# Altium schematic sheet WIFIBT_AP6212.SchDoc
size A4
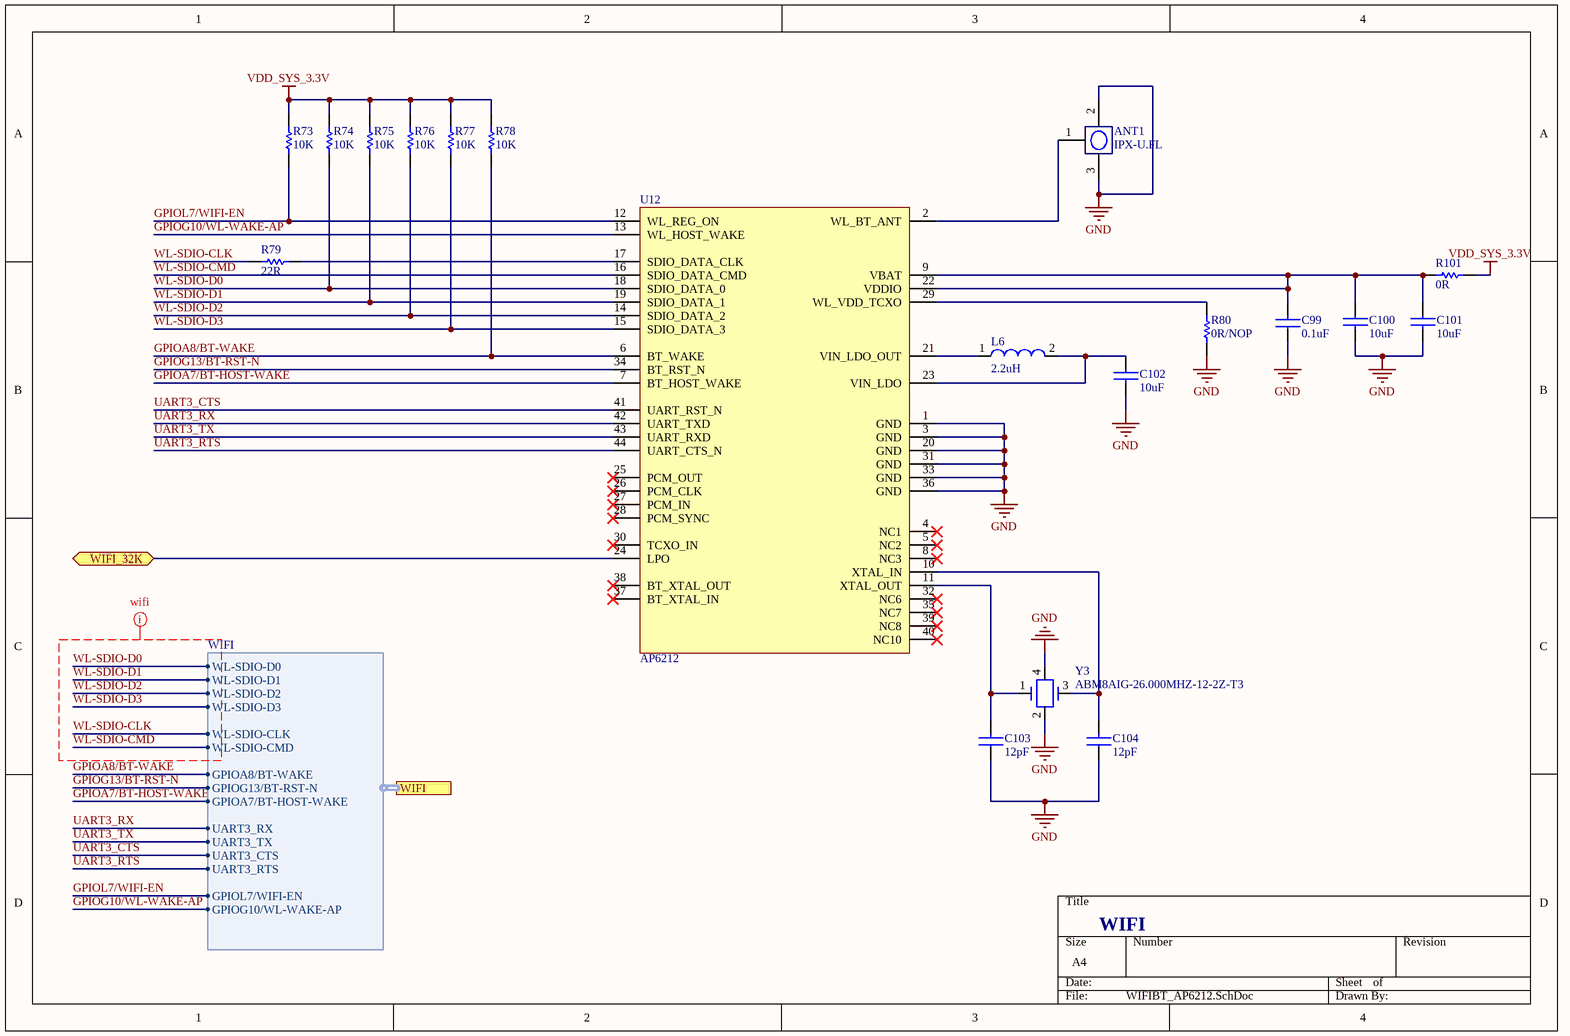
[diagram p0: WIFIBT_AP6212.SchDoc]

## Parts
ANT1  IPX-U.FL  [UFL]
C99  0.1uF  [C0402]
C100  10uF  [C0603]
C101  10uF  [C0603]
C102  10uF  [C0603]
C103  12pF  [C0402]
C104  12pF  [C0402]
L6  2.2uH  [L1008]
R73  value 10K  [R0402]  (hidden comment: 10K,1%)
R74  value 10K  [R0402]  (hidden comment: 10K,1%)
R75  value 10K  [R0402]  (hidden comment: 10K,1%)
R76  value 10K  [R0402]  (hidden comment: 10K,1%)
R77  value 10K  [R0402]  (hidden comment: 10K,1%)
R78  value 10K  [R0402]  (hidden comment: 10K,1%)
R79  22R  [R0402]
R80  0R/NOP  [R0402]
R101  0R  [R0402]
U12  AP6212  [AP6212_44_12X12]
Y3  ABM8AIG-26.000MHZ-12-2Z-T3  [XTL_4_3225]

## Ports
WIFI (harness WIFI), WIFI_32K (bidir)

## Harnesses
WIFI: WL-SDIO-D0, WL-SDIO-D1, WL-SDIO-D2, WL-SDIO-D3, WL-SDIO-CLK, WL-SDIO-CMD, GPIOA8/BT-WAKE, GPIOG13/BT-RST-N, GPIOA7/BT-HOST-WAKE, UART3_RX, UART3_TX, UART3_CTS, UART3_RTS, GPIOL7/WIFI-EN, GPIOG10/WL-WAKE-AP

## Nets
GND: ANT1.2 ANT1.3 C99.1 C100.2 C101.2 C102.2 C103.1 C104.1 R80.1 U12.1(GND) U12.3(GND) U12.20(GND) U12.31(GND) U12.33(GND) U12.36(GND) Y3.2 Y3.4
VDD_SYS_3.3V: R73.2 R74.2 R75.2 R76.2 R77.2 R78.2 R101.1
GPIOA7/BT-HOST-WAKE: U12.7(BT_HOST_WAKE) ; port WIFI.GPIOA7/BT-HOST-WAKE
GPIOA8/BT-WAKE: R78.1 U12.6(BT_WAKE) ; port WIFI.GPIOA8/BT-WAKE
GPIOG10/WL-WAKE-AP: U12.13(WL_HOST_WAKE) ; port WIFI.GPIOG10/WL-WAKE-AP
GPIOG13/BT-RST-N: U12.34(BT_RST_N) ; port WIFI.GPIOG13/BT-RST-N
GPIOL7/WIFI-EN: R73.1 U12.12(WL_REG_ON) ; port WIFI.GPIOL7/WIFI-EN
UART3_CTS: U12.41(UART_RST_N) ; port WIFI.UART3_CTS
UART3_RTS: U12.44(UART_CTS_N) ; port WIFI.UART3_RTS
UART3_RX: U12.42(UART_TXD) ; port WIFI.UART3_RX
UART3_TX: U12.43(UART_RXD) ; port WIFI.UART3_TX
WIFI_32K: U12.24(LPO) ; port WIFI_32K
WL-SDIO-CLK: R79.2 ; port WIFI.WL-SDIO-CLK
WL-SDIO-CMD: U12.16(SDIO_DATA_CMD) ; port WIFI.WL-SDIO-CMD
WL-SDIO-D0: R74.1 U12.18(SDIO_DATA_0) ; port WIFI.WL-SDIO-D0
WL-SDIO-D1: R75.1 U12.19(SDIO_DATA_1) ; port WIFI.WL-SDIO-D1
WL-SDIO-D2: R76.1 U12.14(SDIO_DATA_2) ; port WIFI.WL-SDIO-D2
WL-SDIO-D3: R77.1 U12.15(SDIO_DATA_3) ; port WIFI.WL-SDIO-D3
NetANT1_1: ANT1.1 U12.2(WL_BT_ANT)
NetC99_2: C99.2 C100.1 C101.1 R101.2 U12.9(VBAT) U12.22(VDDIO)
NetC102_1: C102.1 L6.2 U12.23(VIN_LDO)
NetC103_2: C103.2 U12.11(XTAL_OUT) Y3.1
NetC104_2: C104.2 U12.10(XTAL_IN) Y3.3
NetL6_1: L6.1 U12.21(VIN_LDO_OUT)
NetR79_1: R79.1 U12.17(SDIO_DATA_CLK)
NetR80_2: R80.2 U12.29(WL_VDD_TCXO)

Not connected (* = marked no-connect by the designer): U12 4(NC1)* 5(NC2)* 8(NC3)* 25(PCM_OUT)* 26(PCM_CLK)* 27(PCM_IN)* 28(PCM_SYNC)* 30(TCXO_IN)* 32(NC6)* 35(NC7)* 37(BT_XTAL_IN)* 38(BT_XTAL_OUT)* 39(NC8)* 40(NC10)*

## Layout directives
net class WIFI: WL-SDIO-CLK, WL-SDIO-CMD, WL-SDIO-D0, WL-SDIO-D1, WL-SDIO-D2, WL-SDIO-D3

## Notes on the sheet
- WIFI

## Library data of the parts
ANT1 = ANT1: Part number: IPX-U.FL
C99 = CAPC: Part number: GCM188L81H104KA57D; Value: 0.1uF
C100-C102 = CAPC: Part number: GRM188R60J106ME47D; Value: 10uF
C103 C104 = CAPC: Part number: GRM1555C1H120FA01D; Value: 12pF
L6 = SELF: L; Part number: DFE252010-2R2M; Value: 2.2uH
R73-R78 = Res1: Resistor; Part number: CRCW060310K0FKTA; Published: 8-Jun-2000; LatestRevisionDate: 17-Jul-2002; LatestRevisionNote: Re-released for DXP Platform.; PackageReference: AXIAL-0.3; Publisher: Altium Limited; PackageDescription: Axial Device, Thru-Hole; 2 Leads; 0.3 in Pin Spacing
R79 = Res1: Resistor; Part number: CRCW060322R0FKEA; Published: 8-Jun-2000; LatestRevisionDate: 17-Jul-2002; LatestRevisionNote: Re-released for DXP Platform.; PackageReference: AXIAL-0.3; Publisher: Altium Limited; Value: 22R; PackageDescription: Axial Device, Thru-Hole; 2 Leads; 0.3 in Pin Spacing
R80 = Res1: Resistor; Part number: ERJ-2GE0R00X; Published: 8-Jun-2000; LatestRevisionDate: 17-Jul-2002; LatestRevisionNote: Re-released for DXP Platform.; PackageReference: AXIAL-0.3; Publisher: Altium Limited; Value: 0R/NOP; PackageDescription: Axial Device, Thru-Hole; 2 Leads; 0.3 in Pin Spacing
R101 = Res1: Resistor; Part number: ERJ-2GE0R00X; Part number: WSL060300000ZEA9; Published: 8-Jun-2000; LatestRevisionDate: 17-Jul-2002; LatestRevisionNote: Re-released for DXP Platform.; PackageReference: AXIAL-0.3; Publisher: Altium Limited; Value: 0R; PackageDescription: Axial Device, Thru-Hole; 2 Leads; 0.3 in Pin Spacing
U12 = AP6212: WiFi Module; Part number: AP6212
Y3 = CRYS-4P: 32.768KHz MC-306; Part number: ABM8AIG-26.000MHZ-12-2Z-T3